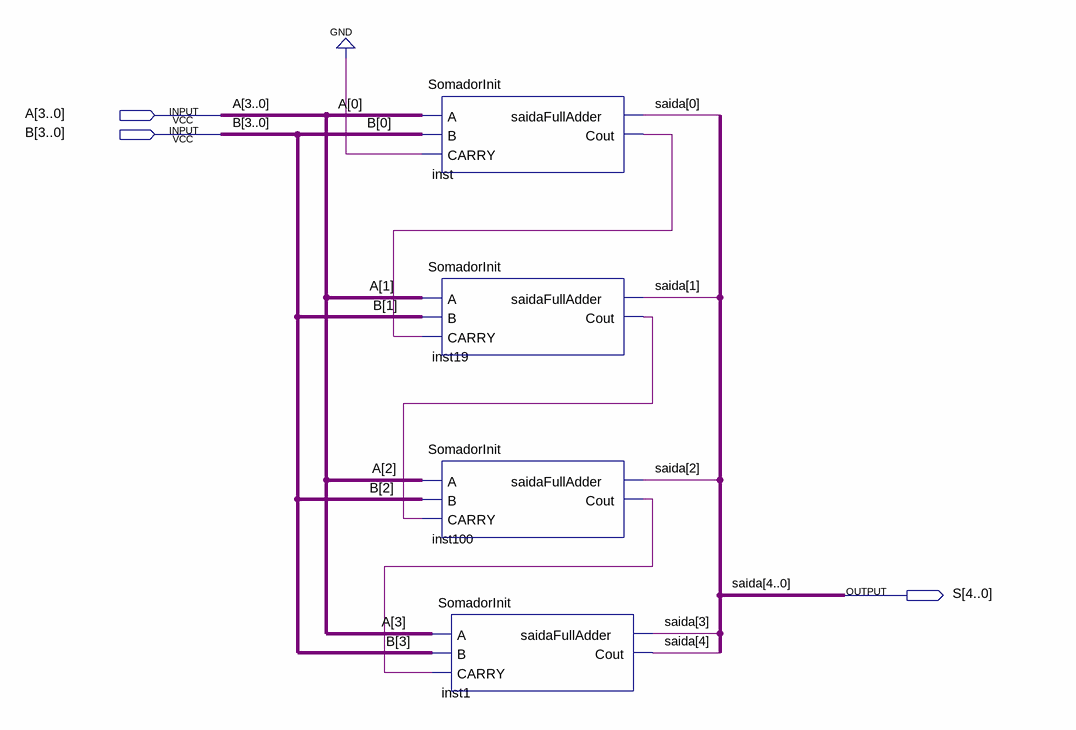
[diagram p0: schematic sheet]
// Quartus schematic hallsom.bdf as structural Verilog: 4 symbols, 3 pins
module hallsom (
  input  [3:0] A,
  input  [3:0] B,
  output [4:0] S
);

  wire inst19_cout, inst100_cout, inst_cout;

  SomadorInit inst (.A(A[0]), .B(B[0]), .CARRY(1'b0), .saidaFullAdder(S[0]), .Cout(inst_cout));
  SomadorInit inst19 (.A(A[1]), .B(B[1]), .CARRY(inst_cout), .saidaFullAdder(S[1]), .Cout(inst19_cout));
  SomadorInit inst100 (.A(A[2]), .B(B[2]), .CARRY(inst19_cout), .saidaFullAdder(S[2]), .Cout(inst100_cout));
  SomadorInit inst1 (.A(A[3]), .B(B[3]), .CARRY(inst100_cout), .saidaFullAdder(S[3]), .Cout(S[4]));

  // Other names for the same wires on the sheet: saida[4:0] = S
endmodule
